# EAGLE design board (EAGLE 9.6.2)
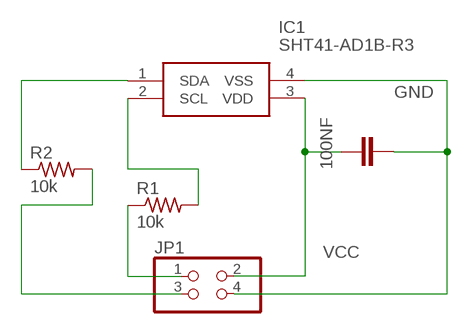
[diagram p0: schematic, sheet 1]

## Parts
100NF  100nF  CC0805KRX7R9BB104  [CAP_0805]
IC1  SHT41-AD1B-R3  [SHT41AD1BR3]
JP1  PINHD-2X2  [2X02]
R1  10k  CRCW08050000Z0EA  [RES_0805]
R2  10k  CRCW08050000Z0EA  [RES_0805]

## Nets
GND: 100NF.2 IC1.4(VSS) JP1.4
N$2: JP1.3 R2.2
N$3: IC1.2(SCL) R1.2
N$4: JP1.1 R1.1
N$6: IC1.1(SDA) R2.1
VCC: 100NF.1 IC1.3(VDD) JP1.2

## Library data of the parts
100NF = Resistor_Capacitor:CC0805KRX7R9BB104: CAP CER 0.1UF 50V X7R 0805 Manufacturer's datasheet <http://www.yageo.com/documents/recent/UPY-GPHC_X7R_6.3V-to-50V_18.pdf>; CREATED_BY: PCBLayout.com; DIGIKEY_PART_NUMBER: 311-1140-2-ND; MANUFACTURER: Yageo; MPN: CC0805KRX7R9BB104; PACKAGE: SMD 0805
IC1 = SamacSys_Parts:SHT41-AD1B-R3: Board Mount Humidity Sensors Intermediate Humidity and Temperature Sensor - Bulk Source: Datasheet <https://www.mouser.fr/datasheet/2/682/Sensirion_Humidity_Sensors_SHT4x_Datasheet-2001050.pdf>; DESCRIPTION: Board Mount Humidity Sensors Intermediate Humidity and Temperature Sensor - Bulk; HEIGHT: 0.59mm; MANUFACTURER_NAME: Sensirion; MANUFACTURER_PART_NUMBER: SHT41-AD1B-R3; MOUSER_PART_NUMBER: 403-SHT41-AD1B-R3; MOUSER_PRICE-STOCK: https://www.mouser.co.uk/ProductDetail/Sensirion/SHT41-AD1B-R3?qs=XAiT9M5g4x9TCtE5W6N3dA%3D%3D
JP1 = pinhead:PINHD-2X2: PIN HEADER
R1 R2 = Resistor_Capacitor:CRCW08050000Z0EA: RES SMD 0 OHM JUMPER 1/8W 0805 Manufacturer's datasheet <http://www.vishay.com/docs/20035/dcrcwe3.pdf>; CREATED_BY: PCBLayout.com; DIGIKEY_PART_NUMBER: 541-0.0ATR-ND; MANUFACTURER: Vishay Dale; MPN: CRCW08050000Z0EA; PACKAGE: SMD 0805

## Board
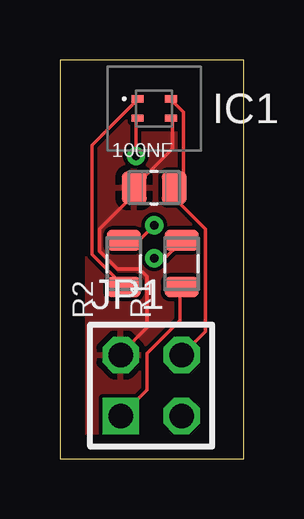
[diagram p1: board, top side]
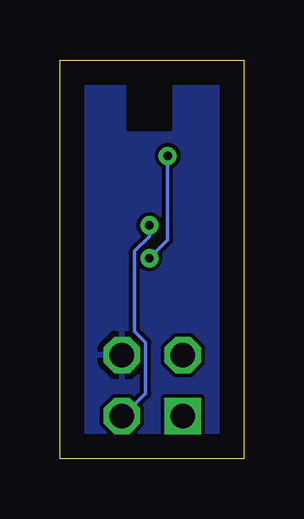
[diagram p2: board, bottom side, seen from below]

Size 7.67 x 16.63 mm. Coordinates in mm from the lower left corner, seen from the top.
Outline: 0,0 7.67,0 7.67,16.63 0,16.63 0,0
Copper layers (1*16): Top 0.035mm / dielectric 1.5mm / Bottom 0.035mm
Design rules "default": minimum track width 6mil, minimum drill 0.35mm, track to track 6mil, track to pad 6mil, pad to pad 6mil, via to via 6mil, smd to smd 6mil, copper to edge 40mil, drill to drill 6mil, minimum pad ring 10mil, minimum via ring 8mil, stop-mask expansion 4mil, vias tented up to drill 0mil, thermal gap 10mil
tKeepout: area 3.3,14 to 4.6,15.2
tRestrict: area 3.4,13.8 to 4.4,15.5

### Footprints (pad centres in the part's own frame; a part is rotated, then mirrored left to right if it is on the bottom)
CAP_0805 = smd 1.05 x 1.38: 1 -0.84,0; 2 0.84,0
SHT41AD1BR3 = smd 0.5 x 0.3: 1 -0.7,0.4; 2 -0.7,-0.4; 3 0.7,-0.4; 4 0.7,0.4
2X02 = drill 1.016 square: 1 -1.27,-1.27 | drill 1.016 octagon: 2 -1.27,1.27; 3 1.27,-1.27; 4 1.27,1.27
RES_0805 = smd 0.87 x 1.42: 1 -0.975,0; 2 0.975,0

### Placement (x,y rotation side)
100NF  3.94,11.3 0 top
IC1  3.94,14.61 0 top
JP1  3.81,3.05 0 top
R1  5.08,8.13 90 top
R2  2.67,8.13 90 top

### Tracks (layer width: path | path; a pad name or v marks a point on that pad's centre or on a via)
CLEAR
  cutout Top (isolate 0.028): 3.3,15.24 4.57,15.24 4.57,13.97 3.3,13.97
  cutout Bottom (isolate 0.028): 3.3,15.24 4.57,15.24 4.57,13.97 3.3,13.97
  cutout Bottom (isolate 0.028): 3.17,15.49 4.83,15.49 4.83,13.72 3.05,13.72 3.05,15.49
  cutout Top (isolate 0.028): 3.05,15.49 4.83,15.49 4.83,13.72 3.05,13.72
GND
  Top 0.152: IC1.4 4.7,14.91 5.16,14.45 5.16,11.71 4.85,11.4 100NF.2 4.85,11.25 4.85,10.79 6.07,9.58 6.07,5.31 JP1.4
  pour Bottom (isolate 0.028): -2.41,17.14 10.29,17.14 10.29,-1.91 -2.41,-1.91
N$1
  cutout Top (isolate 0.028): 3.3,15.24 4.57,15.24 4.57,13.97 3.3,13.97
N$2  (via drill 0.35)
  Top 0.152: v3.94,9.73 3.33,9.12 2.72,9.12 R2.2
  Bottom 0.152: v3.94,9.73 3.94,9.27 4.55,8.66 4.55,5.31 4.09,4.85 4.09,2.72 5,1.8 JP1.3
N$3  (via drill 0.35)
  Top 0.152: v3.17,12.62 3.17,14.15 IC1.2 | v3.94,8.36 4.39,8.36 5,8.97 R1.2
  Bottom 0.152: v3.17,12.62 3.17,9.12 v3.94,8.36
N$4
  Top 0.152: JP1.1 3.63,2.87 3.63,4.39 5,5.77 5,7.14 R1.1
N$6
  Top 0.152: IC1.1 3.17,14.91 1.35,13.08 1.35,8.51 2.57,7.29 R2.1
VCC
  Top 0.152: IC1.3 4.7,14.15 4.7,12.93 3.17,11.4 100NF.1 3.02,11.25 3.02,10.95 1.65,9.58 1.65,8.66 2.41,7.9 3.33,7.9 3.63,7.6 3.63,5.46 2.57,4.39 JP1.2
  pour Top (isolate 0.028): -1.14,17.14 9.02,17.14 9.02,-0.64 -1.14,-0.64